# Altium schematic sheet LED_RGBLight_AD (1).schdoc
size 248 x 138 mm
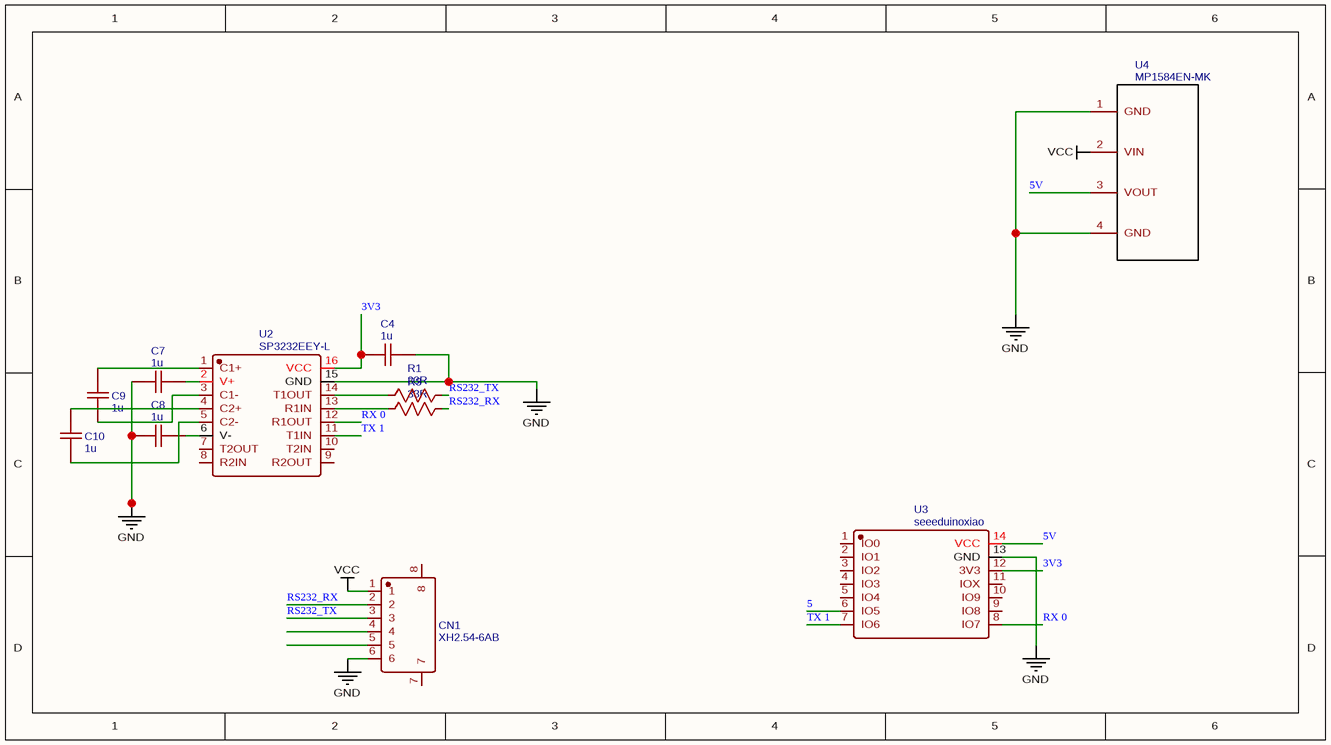
[diagram p0: LED_RGBLight_AD (1).schdoc]

## Parts
C4  1u  [C0603]
C7  1u  [C0603]
C8  1u  [C0603]
C9  1u  [C0603]
C10  1u  [C0603]
CN1  XH2.54-6AB  [CONN-SMD_6P-P2.54_XH2.54-6AB]
R1  33R  [R0603]
R3  33R  [R0603]
U2  SP3232EEY-L  [TSSOP-16_L5.0-W4.4-P0.65-LS6.4-BL]
U3  seeeduinoxiao  [SEEEDUINOXIAO]
U4  MP1584EN-MK  [MP1584EN-MK]

## Nets
GND: C4.2 C7.2 C8.2 CN1.6 U2.15(GND) U3.13(GND) U4.1(GND) U4.4(GND)
VCC: CN1.1 U4.2(VIN)
3V3: C4.1 U2.16(VCC) U3.12(3V3)
5: U3.6(IO5)
5V: U3.14(VCC) U4.3(VOUT)
RS232_RX: CN1.2 R3.2
RS232_TX: CN1.3 R1.2
RX 0: U2.12(R1OUT) U3.8(IO7)
TX 1: U2.11(T1IN) U3.7(IO6)
NetC7_1: C7.1 U2.2(V+)
NetC8_1: C8.1 U2.6(V-)
NetC9_1: C9.1 U2.3(C1-)
NetC9_2: C9.2 U2.1(C1+)
NetC10_1: C10.1 U2.5(C2-)
NetC10_2: C10.2 U2.4(C2+)
NetR1_1: R1.1 U2.14(T1OUT)
NetR3_1: R3.1 U2.13(R1IN)

Not connected (* = marked no-connect by the designer): CN1 4 5 7 8; U2 7(T2OUT) 8(R2IN) 9(R2OUT) 10(T2IN); U3 1(IO0) 2(IO1) 3(IO2) 4(IO3) 5(IO4) 9(IO8) 10(IO9) 11(IOX)

## Library data of the parts
C4 C7-C10 = 1u: nameAlias: Value(F); Contributor: LCEDA_Lib; spicePre: C; spiceSymbolName: C_0603_US
CN1 = XH2.54-6AB: BOM_Manufacturer: Boom Precision Elec; Contributor: LCSC; BOM_Supplier: LCSC; BOM_Supplier Part: C146129; BOM_Manufacturer Part: -; BOM_JLCPCB Part Class: Extended Part; spicePre: C; spiceSymbolName: XH2.54-6AB
R1 R3 = 33R: nameAlias: Value(Ω); Contributor: LCEDA_Lib; spicePre: R; spiceSymbolName: R_0603_US
U2 = SP3232EEY-L: BOM_Manufacturer: MaxLinear; Contributor: LCSC; BOM_Supplier: LCSC; BOM_Supplier Part: C2692307; BOM_Manufacturer Part: SP3232EEY-L; BOM_JLCPCB Part Class: Extended Part; spicePre: U; spiceSymbolName: SP3232EEY-L
U3 = seeeduinoxiao: Contributor: StephenTXZ; spicePre: U; spiceSymbolName: seeeduinoxiao
U4 = MP1584EN-MK: Contributor: Ssu7828; spicePre: U; spiceSymbolName: MP1584EN-MK